# Altium schematic sheet DWS_Comutator.SchDoc
size A4
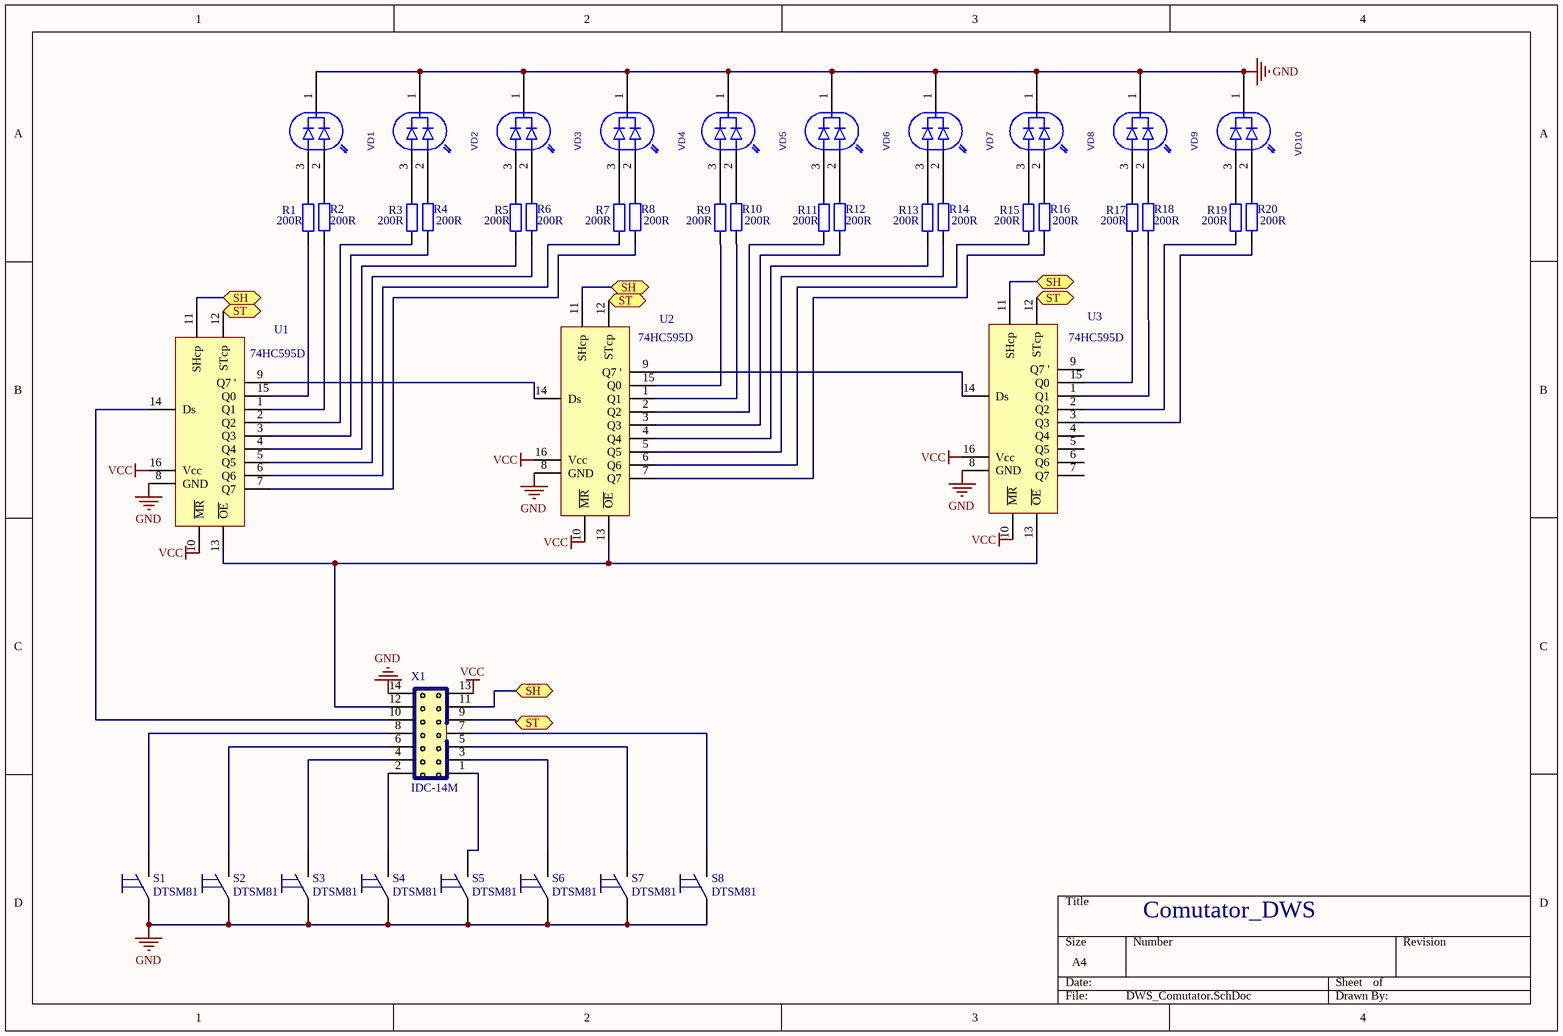
[diagram p0: DWS_Comutator.SchDoc]

## Parts
R1  value 200R  [C0805]  (hidden comment: RES)
R2  value 200R  [C0805]  (hidden comment: RES)
R3  value 200R  [C0805]  (hidden comment: RES)
R4  value 200R  [C0805]  (hidden comment: RES)
R5  value 200R  [C0805]  (hidden comment: RES)
R6  value 200R  [C0805]  (hidden comment: RES)
R7  value 200R  [C0805]  (hidden comment: RES)
R8  value 200R  [C0805]  (hidden comment: RES)
R9  value 200R  [C0805]  (hidden comment: RES)
R10  value 200R  [C0805]  (hidden comment: RES)
R11  value 200R  [C0805]  (hidden comment: RES)
R12  value 200R  [C0805]  (hidden comment: RES)
R13  value 200R  [C0805]  (hidden comment: RES)
R14  value 200R  [C0805]  (hidden comment: RES)
R15  value 200R  [C0805]  (hidden comment: RES)
R16  value 200R  [C0805]  (hidden comment: RES)
R17  value 200R  [C0805]  (hidden comment: RES)
R18  value 200R  [C0805]  (hidden comment: RES)
R19  value 200R  [C0805]  (hidden comment: RES)
R20  value 200R  [C0805]  (hidden comment: RES)
S1  DTSM81  [DTSM81]
S2  DTSM81  [DTSM81]
S3  DTSM81  [DTSM81]
S4  DTSM81  [DTSM81]
S5  DTSM81  [DTSM81]
S6  DTSM81  [DTSM81]
S7  DTSM81  [DTSM81]
S8  DTSM81  [DTSM81]
U1  74HC595D  [SO-16]
U2  74HC595D  [SO-16]
U3  74HC595D  [SO-16]
VD1  LIGHTDIODE2  [LIGHTDIODE2]  (value not drawn)
VD2  LIGHTDIODE2  [LIGHTDIODE2]  (value not drawn)
VD3  LIGHTDIODE2  [LIGHTDIODE2]  (value not drawn)
VD4  LIGHTDIODE2  [LIGHTDIODE2]  (value not drawn)
VD5  LIGHTDIODE2  [LIGHTDIODE2]  (value not drawn)
VD6  LIGHTDIODE2  [LIGHTDIODE2]  (value not drawn)
VD7  LIGHTDIODE2  [LIGHTDIODE2]  (value not drawn)
VD8  LIGHTDIODE2  [LIGHTDIODE2]  (value not drawn)
VD9  LIGHTDIODE2  [LIGHTDIODE2]  (value not drawn)
VD10  LIGHTDIODE2  [LIGHTDIODE2]  (value not drawn)
X1  IDC-14M  [IDC-14M]

## Ports
SH, ST

## Nets
GND: S1.1 S2.1 S3.1 S4.1 S5.1 S6.1 S7.1 S8.1 U1.8(GND) U2.8(GND) U3.8(GND) VD1.1 VD2.1 VD3.1 VD4.1 VD5.1 VD6.1 VD7.1 VD8.1 VD9.1 VD10.1 X1.14
VCC: U1.10(~{MR}) U1.16(Vcc) U2.10(~{MR}) U2.16(Vcc) U3.10(~{MR}) U3.16(Vcc) X1.13
SH: U1.11(SHcp) U2.11(SHcp) U3.11(SHcp) X1.11 ; port SH
ST: U1.12(STcp) U2.12(STcp) U3.12(STcp) X1.9 ; port ST
NetR1_1: R1.1 U1.15(Q0)
NetR1_2: R1.2 VD1.3
NetR2_1: R2.1 U1.1(Q1)
NetR2_2: R2.2 VD1.2
NetR3_1: R3.1 U1.2(Q2)
NetR3_2: R3.2 VD2.3
NetR4_1: R4.1 U1.3(Q3)
NetR4_2: R4.2 VD2.2
NetR5_1: R5.1 U1.4(Q4)
NetR5_2: R5.2 VD3.3
NetR6_1: R6.1 U1.5(Q5)
NetR6_2: R6.2 VD3.2
NetR7_1: R7.1 U1.6(Q6)
NetR7_2: R7.2 VD4.3
NetR8_1: R8.1 U1.7(Q7)
NetR8_2: R8.2 VD4.2
NetR9_1: R9.1 U2.15(Q0)
NetR9_2: R9.2 VD5.3
NetR10_1: R10.1 U2.1(Q1)
NetR10_2: R10.2 VD5.2
NetR11_1: R11.1 U2.2(Q2)
NetR11_2: R11.2 VD6.3
NetR12_1: R12.1 U2.3(Q3)
NetR12_2: R12.2 VD6.2
NetR13_1: R13.1 U2.4(Q4)
NetR13_2: R13.2 VD7.3
NetR14_1: R14.1 U2.5(Q5)
NetR14_2: R14.2 VD7.2
NetR15_1: R15.1 U2.6(Q6)
NetR15_2: R15.2 VD8.3
NetR16_1: R16.1 U2.7(Q7)
NetR16_2: R16.2 VD8.2
NetR17_1: R17.1 U3.15(Q0)
NetR17_2: R17.2 VD9.3
NetR18_1: R18.1 U3.1(Q1)
NetR18_2: R18.2 VD9.2
NetR19_1: R19.1 U3.2(Q2)
NetR19_2: R19.2 VD10.3
NetR20_1: R20.1 U3.3(Q3)
NetR20_2: R20.2 VD10.2
NetS1_2: S1.2 X1.8
NetS2_2: S2.2 X1.6
NetS3_2: S3.2 X1.4
NetS4_2: S4.2 X1.2
NetS5_2: S5.2 X1.1
NetS6_2: S6.2 X1.3
NetS7_2: S7.2 X1.5
NetS8_2: S8.2 X1.7
NetU1_9: U1.9(Q7_') U2.14(Ds)
NetU1_13: U1.13(~{OE}) U2.13(~{OE}) U3.13(~{OE}) X1.12
NetU1_14: U1.14(Ds) X1.10
NetU2_9: U2.9(Q7_') U3.14(Ds)

Not connected (* = marked no-connect by the designer): U3 4(Q4) 5(Q5) 6(Q6) 7(Q7) 9(Q7_')

## Notes on the sheet
- Comutator_DWS

## Library data of the parts
R1-R20 = RES: Resistor
U1-U3 = 74HC595
VD1-VD10 = LIGHTDIODE2: Value: *